# EAGLE design sensor_v2b (EAGLE 6.5.0)
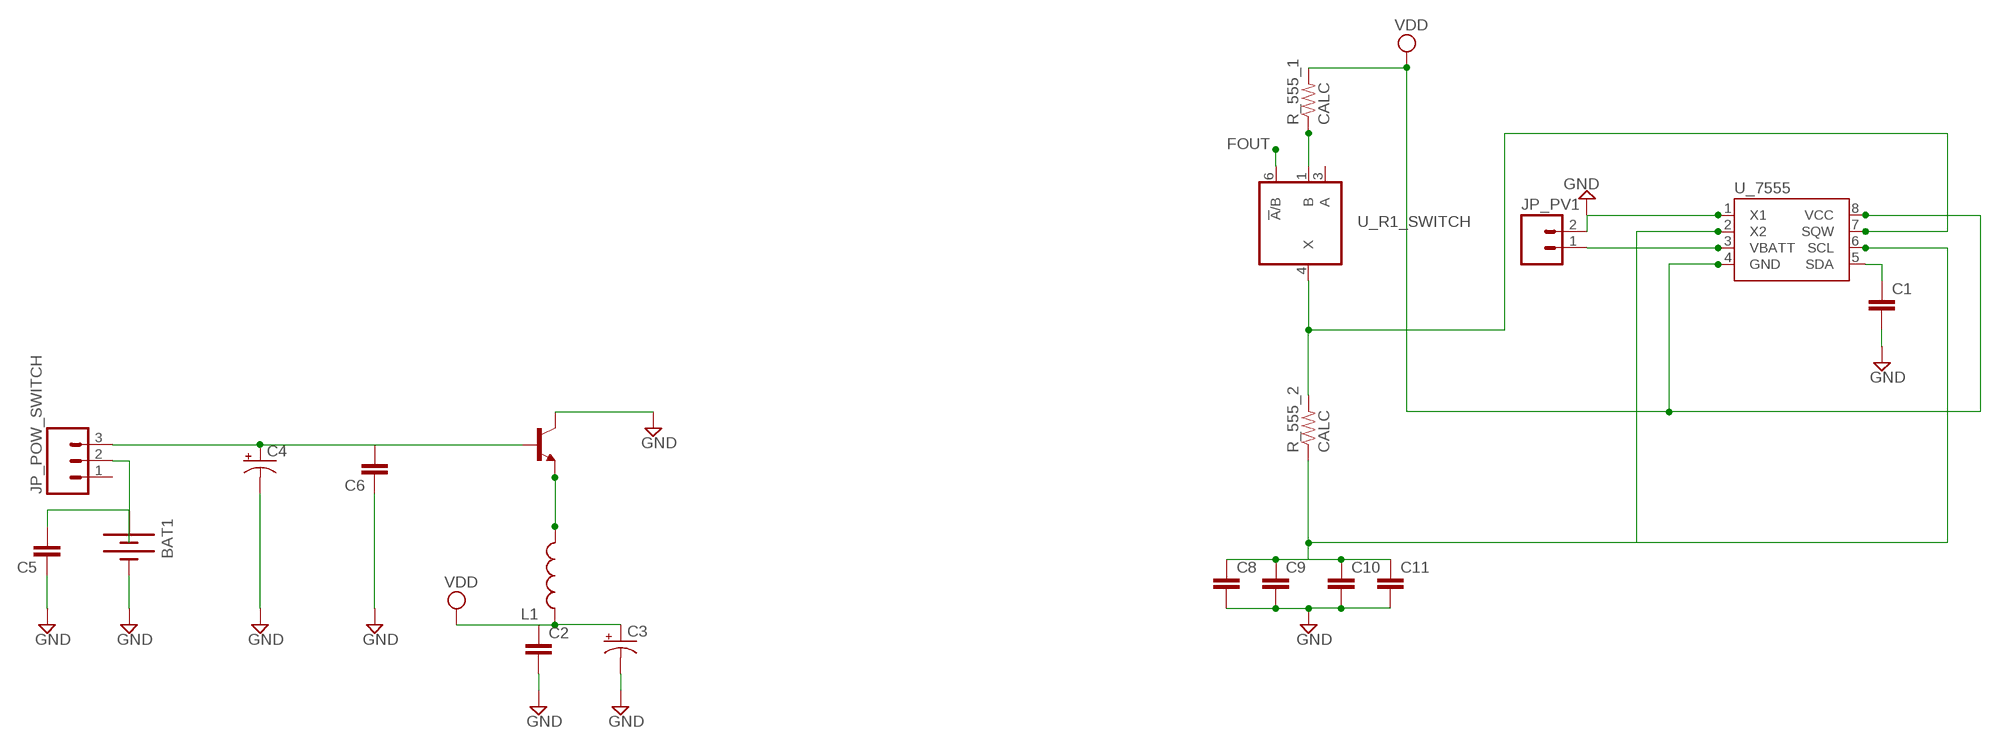
[diagram p0: schematic, sheet 1]

## Parts
BAT1  BATTERY20PTH_LAB  [BATTCOM_20MM_PTH]
C1  CAP0603-CAP  [0603-CAP]
C2  CAP0603-CAP  [0603-CAP]
C3  CAP_POL1206  [EIA3216]
C4  CAP_POL1206  [EIA3216]
C5  CAP0603-CAP  [0603-CAP]
C6  CAP0603-CAP  [0603-CAP]
C8  CAP0805  [0805]
C9  CAP0805  [0805]
C10  CAP0805  [0805]
C11  CAP0805  [0805]
JP_POW_SWITCH  M03LOCK  [1X03_LOCK]
JP_PV1  M02LOCK  [1X02_LOCK]
L1  INDUCTOR0603  [0603]
R_555_1  CALC  RESISTOR0805-RES  [0805]
R_555_2  CALC  RESISTOR0805-RES  [0805]
U_7555  DS1307SO8  [SO08]
U_R1_SWITCH  741G3157DCKR  [DCK_R-PDSO-G6]
U_VREF  TRANSISTOR_NPNSOT23-3  [SOT23-3]

## Nets
FOUT: JP_PV1.1 U_7555.3(VBATT) U_R1_SWITCH.6(!A!/B)
GND: BAT1.2(-) C1.2 C2.2 C3.C(-) C4.C(-) C5.1 C6.1 C8.2 C9.2 C10.2 C11.2 JP_PV1.2 U_7555.1(X1) U_VREF.3(C)
N$6: BAT1.1(+) C5.2 JP_POW_SWITCH.2
P2: C8.1 C9.1 C10.1 C11.1 R_555_2.1 U_7555.2(X2) U_7555.6(SCL)
P5: C1.1 U_7555.5(SDA)
P7: R_555_2.2 U_7555.7(SQW) U_R1_SWITCH.4(X)
R1: R_555_1.1 U_R1_SWITCH.1(B)
VDD: C2.1 C3.A(+) L1.1 R_555_1.2 U_7555.4(GND) U_7555.8(VCC)
VREFIN: C4.A(+) C6.2 JP_POW_SWITCH.3 U_VREF.1(B)
VREFOUT: L1.2 U_VREF.2(E)
Unconnected: JP_POW_SWITCH.1 U_R1_SWITCH.3(A)

## Power pins joined to a net without a drawn wire
GND: U_R1_SWITCH.2(GND)
VCC: U_R1_SWITCH.5(VCC)

## Library data of the parts
BAT1 = semipassiveTag_library:BATTERY: Battery Holders Various common sizes : AA, AAA, 20mm coin cell and 12mm coin cell.
C1 C2 C5 C6 = SparkFun-Capacitors:CAP: Capacitor Standard 0603 ceramic capacitor, and 0.1" leaded capacitor.
C3 C4 = SparkFun-Capacitors:CAP_POL: Capacitor Polarized These are standard SMD and PTH capacitors. Normally 10uF, 47uF, and 100uF in electrolytic and tantalum varieties. Always verify the external diameter of the through hole cap, it varies with capacity, voltage, and manufacturer. The EIA devices should be standard.
C8-C11 = SparkFun:CAP: Capacitor Standard 0603 ceramic capacitor, and 0.1" leaded capacitor.
JP_POW_SWITCH = SparkFun-Connectors:M03: Header 3 Standard 3-pin 0.1" header. Use with straight break away headers (SKU : PRT-00116), right angle break away headers (PRT-00553), swiss pins (PRT-00743), machine pins (PRT-00117), and female headers (PRT-00115). Molex polarized connector foot print use with SKU : PRT-08232 with associated crimp pins and housings.
JP_PV1 = SparkFun-Connectors:M02: Header 2 Standard 2-pin 0.1" header. Use with straight break away headers (SKU : PRT-00116), right angle break away headers (PRT-00553), swiss pins (PRT-00743), machine pins (PRT-00117), and female headers (PRT-00115). Molex polarized connector foot print use with SKU : PRT-08233 with associated crimp pins and housings.
L1 = SparkFun-Passives:INDUCTOR: Inductors Basic Inductor/Choke - 0603 and 1206. Footprints are not proven and vary greatly between part numbers.
R_555_1 R_555_2 = SparkFun-Resistors:RESISTOR: Resistor Basic schematic elements and footprints for 0603, 1206, and PTH resistors.
U_7555 = SparkFun-FreqCtrl:DS1307: I2C real-time clock with battery backup.
U_R1_SWITCH = 74xx-little-de:74*1G3157: Single-Pole, Double-Throw Analog Switch Source: http://focus.ti.com/lit/ds/symlink/sn74lvc1g3157.pdf
U_VREF = SparkFun:TRANSISTOR_NPN: Transistor NPN BJT configuration in SOT23 package. MMBT2222 is the common NPN we use. Double check BCE configuration again layout.

## Board
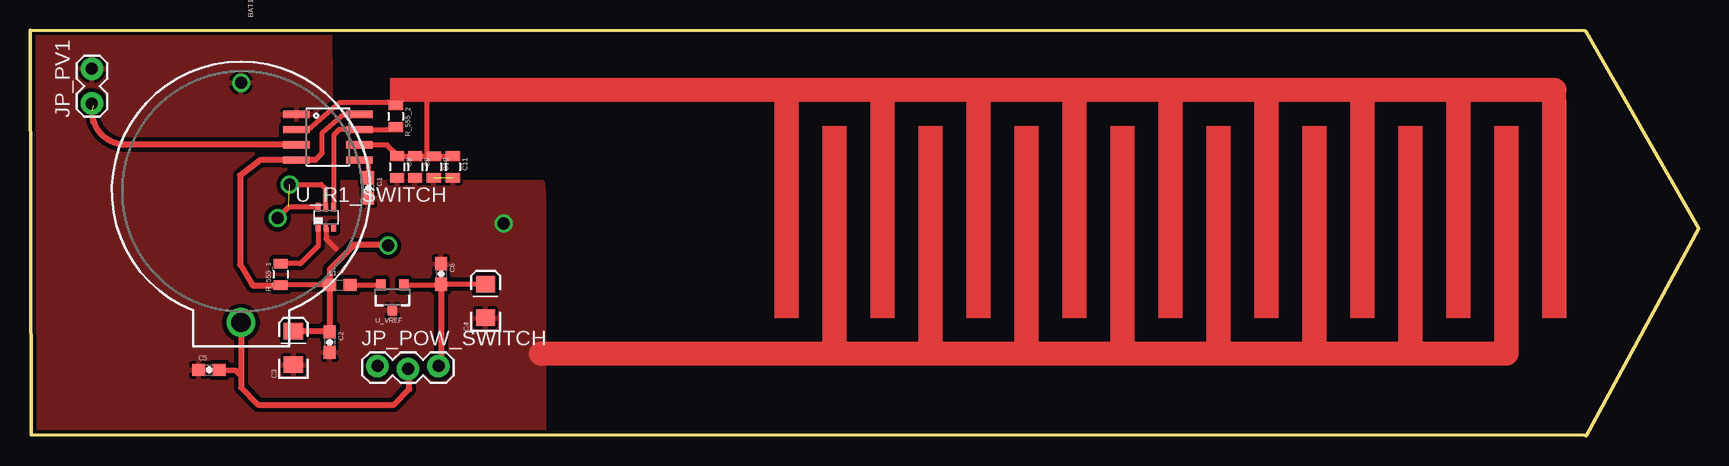
[diagram p1: board, top side]
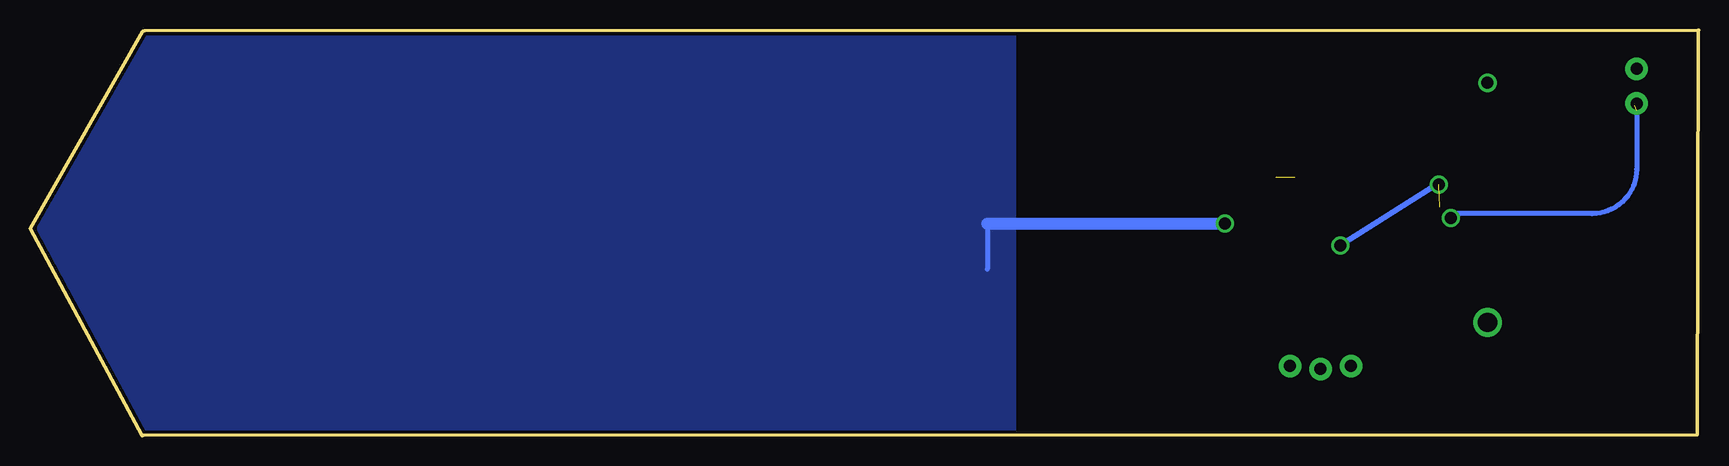
[diagram p2: board, bottom side, seen from below]

Size 139.09 x 33.84 mm. Coordinates in mm from the lower left corner, seen from the top.
Outline: 129.69,33.73 139.09,17.29 129.72,0
Outline: 129.59,0.01 0.1,0.08 0.03,33.84
Outline: 129.54,33.76 0,33.83
Copper layers (1*16): Top 0.035mm / dielectric 1.5mm / Bottom 0.035mm
Design rules "Fusion_eagle_rule_v1.1 *": minimum track width 12mil, minimum drill 12mil, track to track 14mil, track to pad 14mil, pad to pad 14mil, via to via 14mil, smd to smd 0mil, copper to edge 10mil, drill to drill 10mil, minimum pad ring 10mil, minimum via ring 6mil, stop-mask expansion 2mil, vias tented up to drill 100mil, thermal gap 10mil

### Footprints (pad centres in the part's own frame; a part is rotated, then mirrored left to right if it is on the bottom)
BATTCOM_20MM_PTH = drill 1.6: 1 19.99,0 | drill 1: 2 0,0
0603-CAP = smd 1.1 x 1: 1 -0.85,0; 2 0.85,0
EIA3216 = smd 1.4 x 1.6: A 1.4,0; C -1.4,0
0805 = smd 0.8 x 1.2: 1 -0.9,0; 2 0.9,0
1X03_LOCK = drill 1 pad 1.88: 1 0,0.127; 2 2.54,-0.127; 3 5.08,0.127
1X02_LOCK = drill 1 pad 1.88: 1 -0.178,0; 2 2.718,0
0603 = smd 1.1 x 1: 1 -0.85,0; 2 0.85,0
SO08 = smd 0.61 x 2.21: 1 -1.905,-2.616; 2 -0.635,-2.616; 3 0.635,-2.616; 4 1.905,-2.616; 5 1.905,2.616; 6 0.635,2.616; 7 -0.635,2.616; 8 -1.905,2.616
DCK_R-PDSO-G6 = smd 0.4 x 0.7: 1 -0.65,-0.85; 2 0,-0.85; 3 0.65,-0.85; 4 0.65,0.85; 5 0,0.85; 6 -0.65,0.85
SOT23-3 = smd 0.8 x 0.9: 1 -0.95,-1; 2 0.95,-1; 3 0,1.1

### Placement (x,y rotation side)
BAT1  17.59,29.42 270 top
C1  28.2,20.66 270 top
C2  24.98,7.79 270 top
C3  21.96,7.32 90 top
C4  37.97,11.23 90 top
C5  14.92,5.48 0 top
C6  34.26,13.49 270 top
C8  30.6,22.42 270 top
C9  32.1,22.42 270 top
C10  33.66,22.41 270 top
C11  35.25,22.42 270 top
JP_POW_SWITCH  28.97,5.68 0 top
JP_PV1  5.16,27.88 90 top
L1  25.83,12.56 0 top
R_555_1  20.89,13.45 270 top
R_555_2  30.49,26.63 270 top
U_7555  24.84,24.89 270 top
U_R1_SWITCH  24.67,18.21 0 top
U_VREF  30.21,11.57 180 top

### Tracks (layer width: path | path; a pad name or v marks a point on that pad's centre or on a via)
FOUT  (via drill 1)  (2 unrouted)
  Top 0.4: U_R1_SWITCH.6 21.55,19.06 v20.63,18.14
  Top 0.5: U_7555.3 8.01,24.26 arc-90 5.17,27.1 | 5.33,27.53 JP_PV1.1
  Top 0.61: 22.21,24.25 arc45 U_7555.3
  Bottom 0.4: v20.63,18.14 arc90 20.25,18.52 8.86,18.52 arc-90 5.17,22.21 JP_PV1.1
  Bottom 0.5: JP_PV1.1 | v21.66,20.94 21.8,20.94 v29.84,15.85
GND  (via drill 1)  (1 unrouted)
  Top 0.4: U_R1_SWITCH.2 24.67,16.42 25.51,15.58
  Top 2: 54.57,6.83 42.57,6.83
  Bottom 0.406: 59.28,17.68 59.28,13.88
  Bottom 1.016: 59.28,17.68 v39.49,17.71
  pour Top: 12.97,38.25 -9.63,38.03 -9.64,28.03 -9.89,22.76 -10.08,18.51 -11.03,-8.77 42.86,-9.54 42.86,19.53 42.77,21.09 24.99,21.15 25.07,30.19 24.93,38.11
  pour Bottom: 57.07,37.48 140.43,37.53 140.18,-2.81 57.07,-2.77
N$4
  Top 2: 123.07,7.83 123.07,6.83 51.07,6.83
N$5
  Top 0.4: 21.66,20.95 24.28,20.95 24.55,20.68 24.66,20.57 24.66,19.1
N$6
  Top 0.5: BAT1.1 17.59,4.98 | 17.59,4.98 17.59,4.01 19.02,2.58 30.32,2.58 31.62,3.88 31.62,5.44 JP_POW_SWITCH.2 | C5.2 17.14,5.43 17.59,4.98
N$7
  Top 0.5: 29.77,15.9 27.01,15.9 24.98,13.87 24.98,12.58 24.96,12.56
P2
  Top 0.305: 29.78,24.26 29.78,24.13 30.57,23.33
  Top 0.406: 22.3,25.5 22.17,25.5 U_7555.2 23.19,25.5 25.87,27.81 30.57,27.81 | 29.82,27.82 30.27,27.82 30.57,27.81 | U_7555.6 29.77,24.26 | 50.57,28.33 50.37,28.53 50.37,28.82 51.06,28.82 51.07,28.83 | 31.57,28.09 31.57,28.83 | 29.78,24.26 29.77,24.26 | 29.77,24.26 29.77,24.23 30.47,23.58 30.92,23.38 30.92,23.33 | 33.12,28.83 33.12,23.33 C10.1 | 30.57,27.81 R_555_2.1 | 30.57,27.81 31.07,28.83 | C8.1 C9.1 | C10.1 C11.1 | 30.57,23.33 C9.1 | C9.1 C10.1
  Top 2: 127.07,27.83 127.07,28.83 51.07,28.83 33.12,28.83 31.57,28.83 31.07,28.83
P5
  Top 0.406: U_7555.5 28.2,22.99 C1.1
P7
  Top 0.406: U_R1_SWITCH.4 25.32,25.08 25.77,25.53 U_7555.7 29.84,25.53 R_555_2.2
R1
  Top 0.4: U_R1_SWITCH.1 24.02,15.81 22.56,14.35 R_555_1.1
VDD
  Top 0.406: U_7555.4 23.78,22.99 24.36,23.57 24.36,25.29 25.97,26.69 26.76,26.77 U_7555.8 | L1.1 R_555_1.2
  Top 0.5: 23.78,22.99 19.18,22.97 17.52,21.71 17.52,14.27 18.55,12.54 20.87,12.53 R_555_1.2 | L1.1 C2.1 24.9,8.72 C3.A
VREFIN
  Top 0.406: U_VREF.1 34.27,12.57 C6.2 C4.A
  Top 0.5: 34.27,12.57 34.27,6.02 JP_POW_SWITCH.3
VREFOUT
  Top 0.406: L1.2 U_VREF.2
(copper drawn outside any net)
  shapes: Top area x19